# EAGLE design tiny84xbee-humi_dualProbe_v4 (EAGLE 5.10)
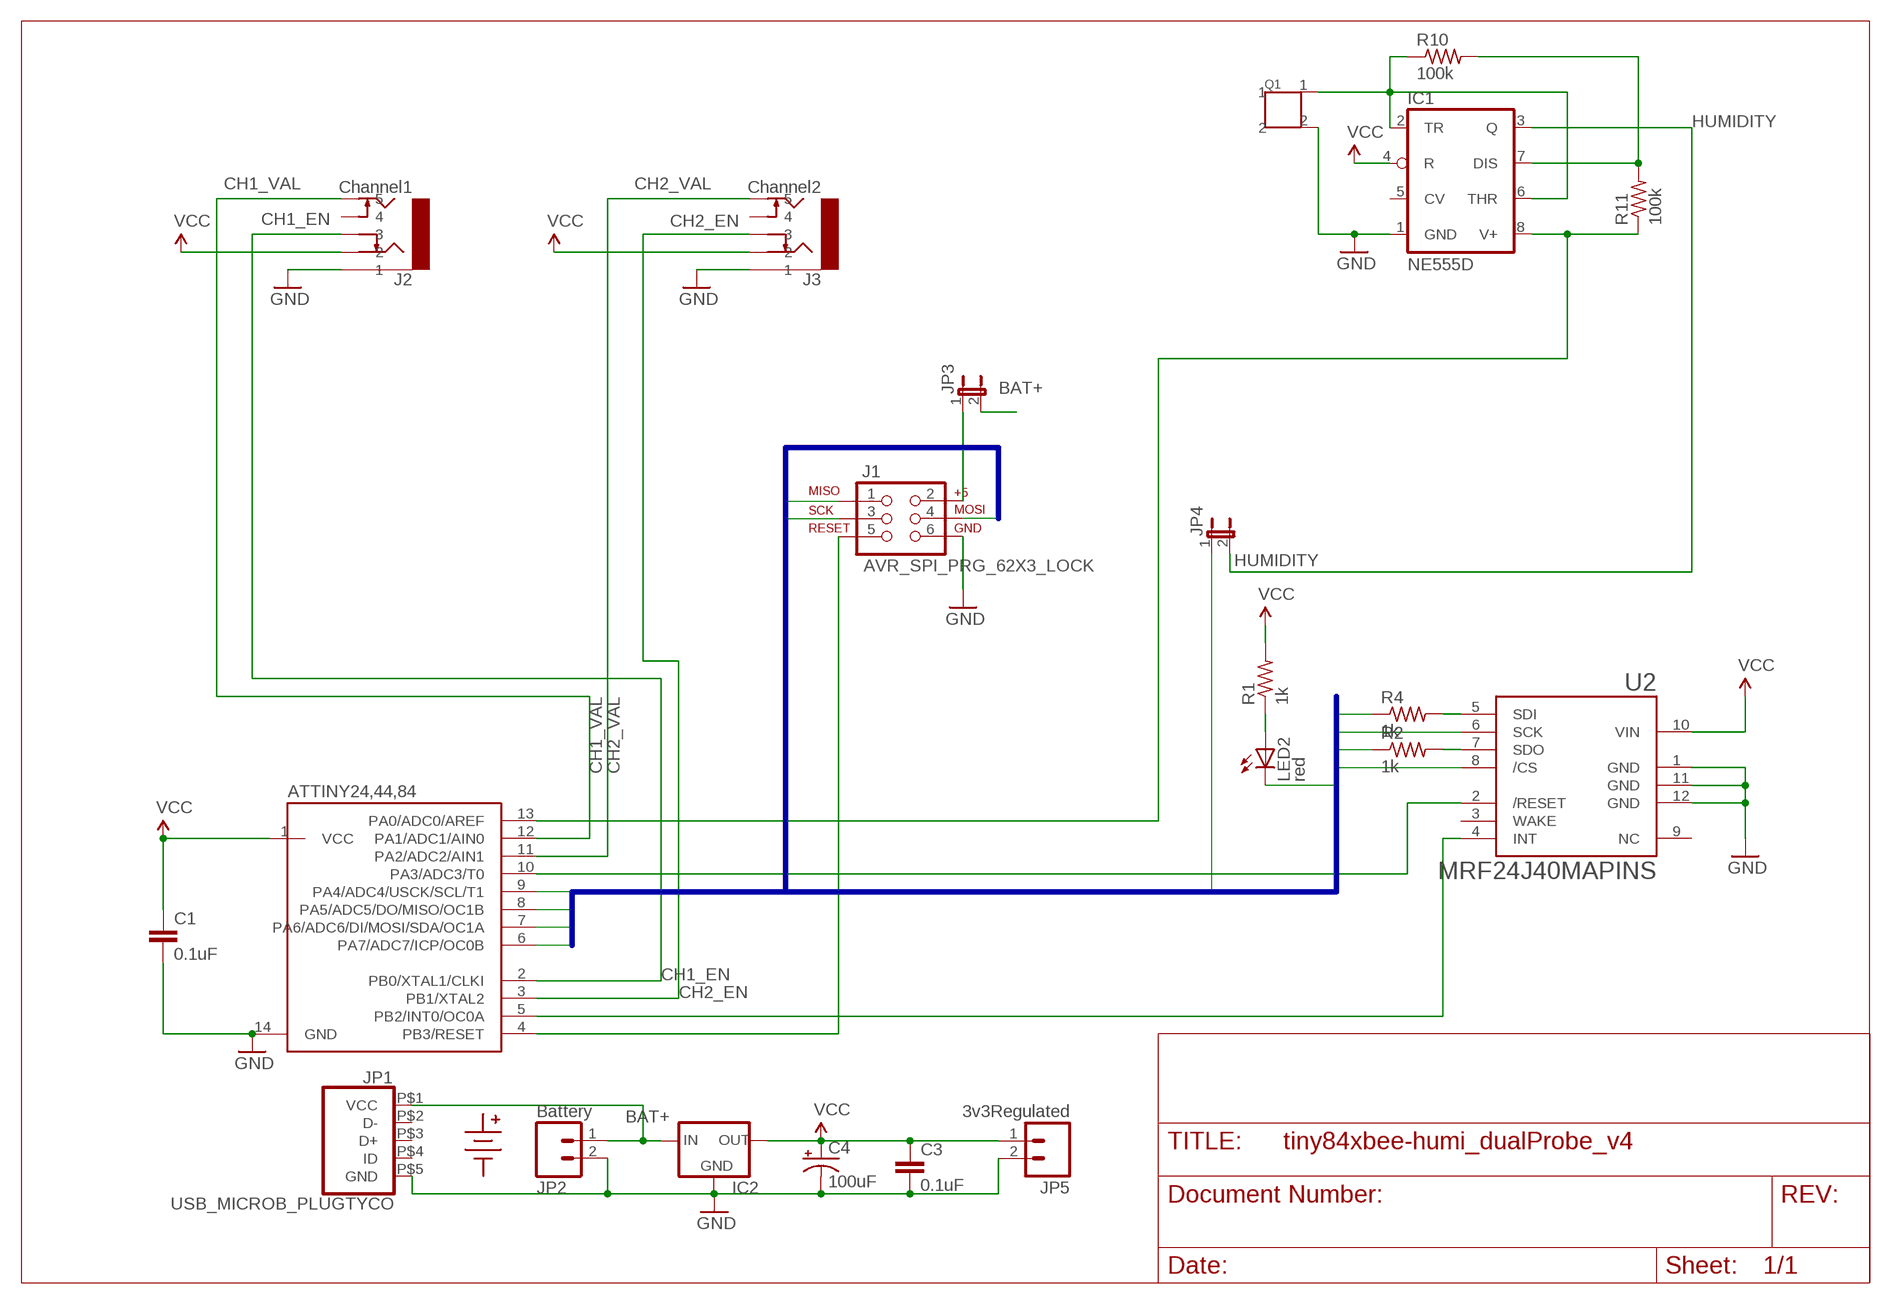
[diagram p0: schematic, sheet 1]

## Parts
ATTINY24,44,84  ATTINY24PDIP  [DIL14]
C1  0.1uF  C-EUC0805K  [C0805K]
C3  0.1uF  C-EU050-035X075  [C050-035X075]
C4  100uF  CPOL-USE2-5  [E2-5]
IC1  NE555D  [SO08]
IC2  MCP1700INLINE  [TO92-INLINE]
J1  AVR_SPI_PRG_62X3_LOCK  [2X3_LOCK]
J2  Channel1  AUDIO-JACK-5PKYCON-STX-315X-5-XX  [KYCON-STX-315X-5-XX]
J3  Channel2  AUDIO-JACK-5PKYCON-STX-315X-5-XX  [KYCON-STX-315X-5-XX]
JP1  USB_MICROB_PLUGTYCO  [TYCO_1981568_MICROB]
JP2  Battery  M02PTH  [1X02]
JP3  JUMPER-2PTH  [1X02]
JP4  JUMPER-2PTH  [1X02]
JP5  3v3Regulated  M02PTH  [1X02]
LED2  red  LED3MM  [LED3MM]
Q1  HCH1000  [HCH1000-001]
R1  1k  R-US_R0805  [R0805]
R2  1k  R-US_0207/10  [0207/10]
R4  1k  R-US_0207/10  [0207/10]
R10  100k  R-US_R0805  [R0805]
R11  100k  R-US_R0805  [R0805]
U2  MRF24J40MAPINS  [MRF24J40MA]
U$1  BATTERY_LEADS  [KEYSTONE-2463]

## Nets
/CS: ATTINY24,44,84.6(PA7/ADC7/ICP/OC0B) LED2.K(C) U2.8(/CS)
BAT+: IC2.2(IN) JP1.P$1(VCC) JP2.1 JP3.2
CH1_EN: ATTINY24,44,84.2(PB0/XTAL1/CLKI) J2.P$5
CH1_VAL: ATTINY24,44,84.12(PA1/ADC1/AIN0) J2.P$4
CH2_EN: ATTINY24,44,84.3(PB1/XTAL2) J3.P$5
CH2_VAL: ATTINY24,44,84.11(PA2/ADC2/AIN1) J3.P$4
GND: ATTINY24,44,84.14(GND) C1.2 C3.2 C4.- IC1.1(GND) IC2.1(GND) J1.6 J2.P$1 J3.P$1 JP1.P$5(GND) JP2.2 JP5.2 Q1.2 U2.1(GND) U2.11(GND) U2.12(GND)
HUMIDITY: IC1.3(Q) JP4.2
ICP5V: J1.2 JP3.1
MISO: ATTINY24,44,84.8(PA5/ADC5/DO/MISO/OC1B) J1.1 R2.1
MOSI: ATTINY24,44,84.7(PA6/ADC6/DI/MOSI/SDA/OC1A) J1.4 R4.1
N$1: IC1.2(TR) IC1.6(THR) Q1.1 R10.1
N$2: R2.2 U2.7(SDO)
N$3: R4.2 U2.5(SDI)
N$4: IC1.7(DIS) R10.2 R11.2
N$5: LED2.A R1.1
N$6: ATTINY24,44,84.4(PB3/RESET) J1.5
N$7: ATTINY24,44,84.10(PA3/ADC3/T0) U2.2(/RESET)
N$8: ATTINY24,44,84.13(PA0/ADC0/AREF) IC1.8(V+) R11.1
N$10: ATTINY24,44,84.5(PB2/INT0/OC0A) U2.4(INT)
SCK: ATTINY24,44,84.9(PA4/ADC4/USCK/SCL/T1) J1.3 JP4.1 U2.6(SCK)
VCC: ATTINY24,44,84.1(VCC) C1.1 C3.1 C4.+ IC1.4(R) IC2.3(OUT) J2.P$2 J3.P$2 JP5.1 R1.2 U2.10(VIN)
Unconnected: IC1.5(CV) J2.P$3 J3.P$3 JP1.P$2(D-) JP1.P$3(D+) JP1.P$4(ID) U2.3(WAKE) U2.9(NC)

## Buses
MISO,MOSI,SCK,/CS

## Library data of the parts
ATTINY24,44,84 = karlnet-parts:ATTINY24: ATtiny24/44/84. pdip and qfn packages, but the QFN package does _not_ have the bottom pad connected to ground. (doing so would make a 15 pad package, and you couldn't have PDIP and QFN in the same part)
C1 C3 = resistor:C-EU: CAPACITOR, European symbol
C4 = resistor:CPOL-US: POLARIZED CAPACITOR, American symbol
IC1 = adafruit:*555: TIMER Changed DIP package to have round (not oval) pin pads http://www.ladyada.net/library/pcb/eaglelibrary.html
IC2 = karlnet-parts:MCP1700: VOLTAGE REGULATOR
J1 = karlnet-parts:AVR_SPI_PRG_6: AVR ISP 6 Pin This is the reduced ISP connector for AVR programming. Common on Arduino. This footprint will take up less PCB space and can be used with a 10-pin to 6-pin adapter such as SKU: BOB-08508
J2 J3 = karlnet-parts:AUDIO-JACK-5P: Stereo Audio Jack, with switches for each signal contact
JP1 = karlnet-parts:USB_MICROB_PLUG: USB Micro-B Plug Comes in a variety of packages. Check out Hirose's ZX-x0 line: http://www.hirose.co.jp/cataloge_hp/e24200011.pdf
JP2 JP5 = SparkFun:M02: Header 2 Standard 2-pin 0.1" header. Use with straight break away headers (SKU : PRT-00116), right angle break away headers (PRT-00553), swiss pins (PRT-00743), machine pins (PRT-00117), and female headers (PRT-00115). Molex polarized connector foot print use with SKU : PRT-08233 with associated crimp pins and housings.
JP3 JP4 = SparkFun:JUMPER-2: Jumper Basic 0.1" spaced jumper. Use with breakaway headers.
LED2 = adafruit:LED: LED OSRAM: - CHIPLED LG R971, LG N971, LY N971, LG Q971, LY Q971, LO R971, LY R971 LH N974, LH R974 LS Q976, LO Q976, LY Q976 LO Q996 - Hyper CHIPLED LW Q18S LB Q993, LB Q99A, LB R99A - SideLED LS A670, LO A670, LY A670, LG A670, LP A670 LB A673, LV A673, LT A673, LW A673 LH A674 LY A675 LS A676, LA A676, LO A676, LY A676, LW A676 LS A679, LY A679, LG A679 - Hyper Micro SIDELED® LS Y876, LA Y876, LO Y876, LY Y876 LT Y87S - SmartLED LW L88C, LW L88S LB L89C, LB L89S, LG L890 LS L89K, LO L89K, LY L89K LS L896, LA L896, LO L896, LY L896 - TOPLED LS T670, LO T670, LY T670, LG T670, LP T670 LSG T670, LSP T670, LSY T670, LOP T670, LYG T670 LG T671, LOG T671, LSG T671 LB T673, LV T673, LT T673, LW T673 LH T674 LS T676, LA T676, LO T676, LY T676, LB T676, LH T676, LSB T676, LW T676 LB T67C, LV T67C, LT T67C, LS T67K, LO T67K, LY T67K, LW E67C LS E67B, LA E67B, LO E67B, LY E67B, LB E67C, LV E67C, LT E67C LW T67C LS T679, LY T679, LG T679 LS T770, LO T770, LY T770, LG T770, LP T770 LB T773, LV T773, LT T773, LW T773 LH T774 LS E675, LA E675, LY E675, LS T675 LS T776, LA T776, LO T776, LY T776, LB T776 LHGB T686 LT T68C, LB T68C - Hyper Mini TOPLED® LB M676 - Mini TOPLED Santana® LG M470 LS M47K, LO M47K, LY M47K Source: http://www.osram.convergy.de/
Q1 = karlnet-parts:HCH1000: HCH1000 Capacitive Humidity Sensor Honeywell, cheap, capacitance varies with humidity
R1 R2 R4 R10 R11 = resistor:R-US_: RESISTOR, American symbol
U2 = karlnet-parts:MRF24J40MA
U$1 = karlnet-parts:BATTERY_LEADS: Battery holders with leads, ie, mechanical placement only, no electrical connections

## Board
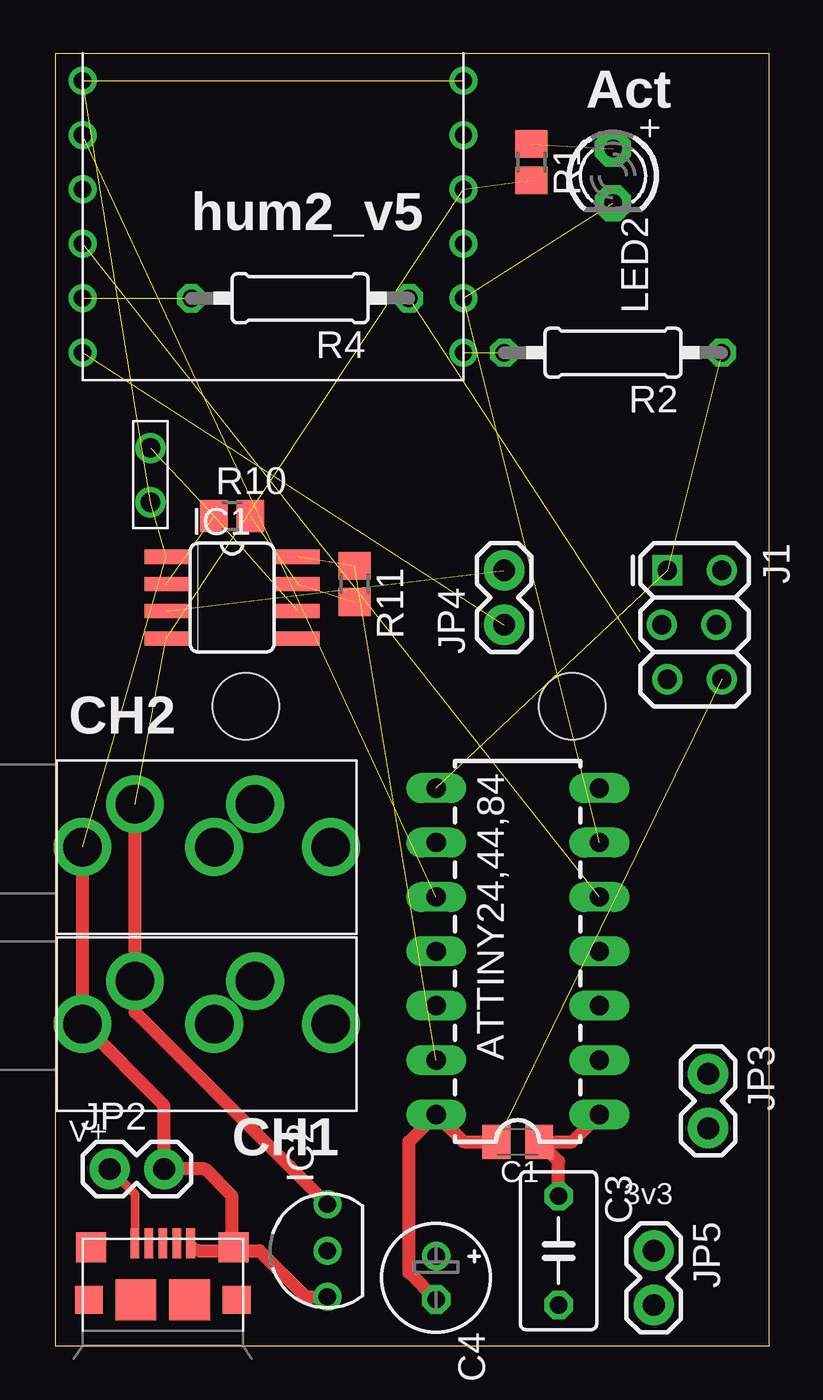
[diagram p1: board, top side]
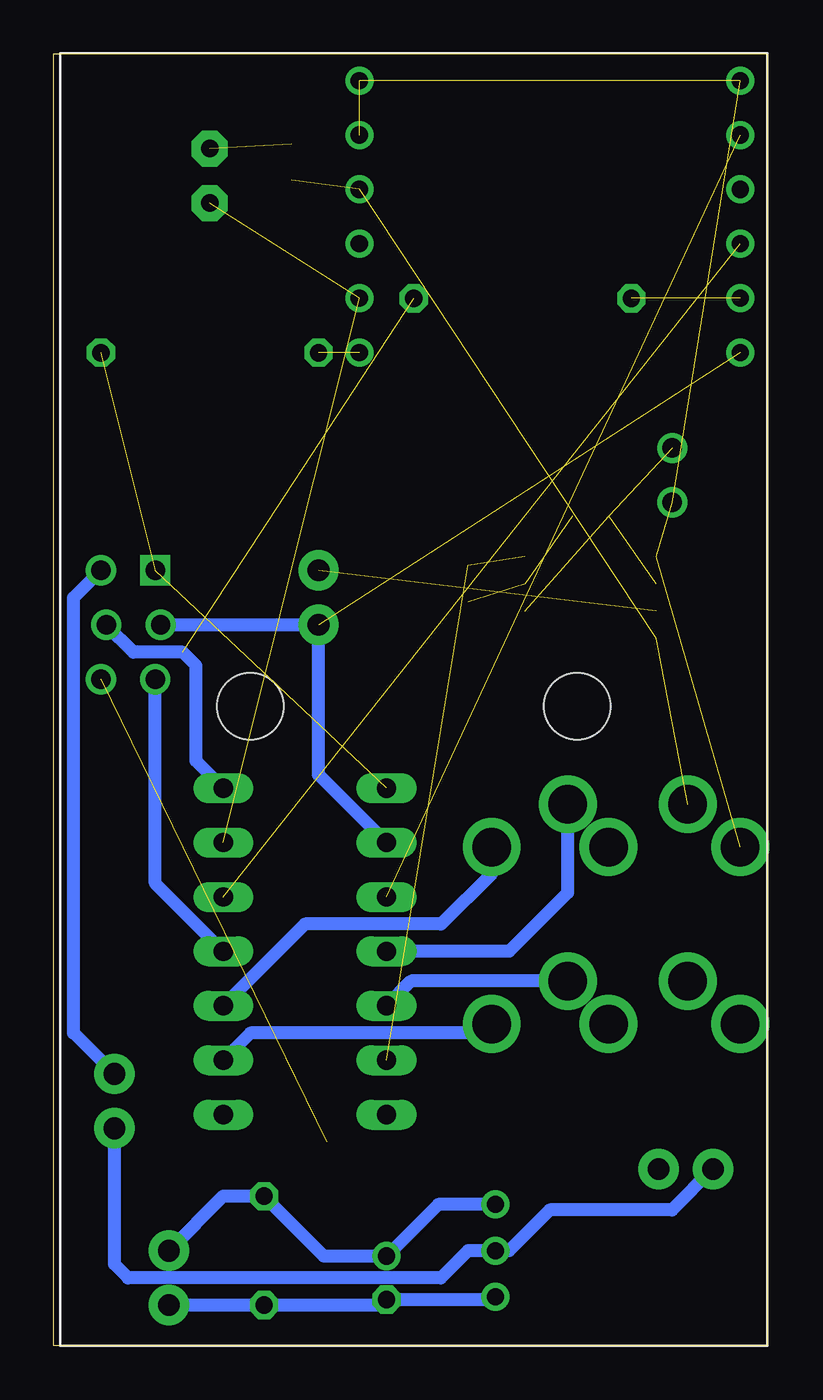
[diagram p2: board, bottom side, seen from below]

Size 33.33 x 60.31 mm. Coordinates in mm from the lower left corner, seen from the top.
Outline: 0,0 33.33,0 33.33,60.31 0,60.31 0,0
Copper layers (1*16): Top 0.035mm / dielectric 1.5mm / Bottom 0.035mm
Design rules "olimex-10mils": minimum track width 10mil, minimum drill 24mil, track to track 10mil, track to pad 10mil, pad to pad 10mil, via to via 10mil, smd to smd 10mil, copper to edge 40mil, drill to drill 10mil, minimum pad ring 10mil, minimum via ring 8mil, stop-mask expansion 0mil, vias tented up to drill 0mil, thermal gap 10mil

### Footprints (pad centres in the part's own frame; a part is rotated, then mirrored left to right if it is on the bottom)
DIL14 = drill 0.9 long: 1 -8.89,-3.81; 2 -6.35,-3.81; 3 -3.81,-3.81; 4 -1.27,-3.81; 5 1.27,-3.81; 6 3.81,-3.81; 7 6.35,-3.81; 8 6.35,3.81; 9 3.81,3.81; 10 1.27,3.81; 11 -1.27,3.81; 12 -3.81,3.81; 13 -6.35,3.81; 14 -8.89,3.81
C0805K = smd 1.3 x 1.6: 1 -1,0; 2 1,0
C050-035X075 = drill 0.813 octagon: 1 -2.54,0; 2 2.54,0
E2-5 = drill 0.813 pad 1.27 round: + -1.016,0 | drill 0.813 pad 1.27 octagon: - 1.016,0
SO08 = smd 0.66 x 2.032: 1 -1.905,-3.073; 2 -0.635,-3.073; 3 0.635,-3.073; 4 1.905,-3.073; 5 1.905,3.073; 6 0.635,3.073; 7 -0.635,3.073; 8 -1.905,3.073
TO92-INLINE = drill 0.8 round: 1 -2.159,0; 2 0,0; 3 2.159,0
2X3_LOCK = drill 0.9 square: 1 0,0 | drill 0.9 round: 2 0,2.54; 3 2.54,-0.254; 4 2.54,2.286; 5 5.08,0; 6 5.08,2.54
KYCON-STX-315X-5-XX = drill 1.8 pad 2.3 round: P$1 -3.88,0.42; P$2 -1.43,2.42; P$3 2.27,0.42; P$4 4.17,2.42; P$5 7.72,0.42
TYCO_1981568_MICROB = smd 0.4 x 1.4: P$1 2.45,4.8; P$2 3.1,4.8; P$3 3.75,4.8; P$4 4.4,4.8; P$5 5.05,4.8 | smd 1.3 x 1.3: P$6 0.3,2.15; P$7 7.2,2.15 | smd 1.9 x 1.9: P$8 2.5,2.15; P$9 5,2.15 | smd 1.4 x 1.4: P$10 0.4,4.6; P$11 7.05,4.6
1X02 = drill 1.016 pad 1.88 round: 1 0,0; 2 2.54,0
LED3MM = drill 0.813 pad 1.676 octagon: A -1.27,0; K 1.27,0
HCH1000-001 = drill 0.9 round: 1 -2.54,0; 2 0,0
R0805 = smd 1.3 x 1.5: 1 -0.85,0; 2 0.85,0
0207/10 = drill 0.813 octagon: 1 -5.08,0; 2 5.08,0
MRF24J40MA = drill 0.8 round: 1 -8.89,12.7; 2 -8.89,10.16; 3 -8.89,7.62; 4 -8.89,5.08; 5 -8.89,2.54; 6 -8.89,0; 7 8.89,0; 8 8.89,2.54; 9 8.89,5.08; 10 8.89,7.62; 11 8.89,10.16; 12 8.89,12.7
KEYSTONE-2463 = hole 3.1: 29.845,8.89; 29.845,24.13

### Placement (x,y rotation side)
ATTINY24,44,84  21.59,19.68 90 top
C1  21.59,9.53 180 top
C3  23.5,4.45 270 top
C4  17.78,3.17 270 top
IC1  8.26,34.92 270 top
IC2  12.7,4.45 90 top
J1  28.57,36.2 270 top
J2  5.15,14.61 0 top
J3  5.15,22.86 0 top
JP1  1.27,0 0 top
JP2  2.54,8.26 0 top
JP3  30.48,12.7 270 top
JP4  20.95,33.66 90 top
JP5  27.94,4.45 270 top
LED2  26.04,54.61 270 top
Q1  4.45,39.37 270 top
R1  22.23,55.24 270 top
R2  26.04,46.35 180 top
R4  11.43,48.9 180 top
R10  8.26,38.73 0 top
R11  13.97,35.56 270 top
U2  10.16,46.35 0 top
U$1  33.02,0 90 top

### Tracks (layer width: path | path; a pad name or v marks a point on that pad's centre or on a via)
/CS  (2 unrouted)
BAT+
  Top 0.406: JP1.P$1 3.72,7.08 JP2.1
  Bottom 0.61: JP2.1 4.45,6.35 10.16,6.35 12.06,4.45 IC2.2 13.97,4.45 15.24,3.17 29.84,3.17 30.48,3.81 JP3.2
CH1_EN
  Bottom 0.61: ATTINY24,44,84.2 24.13,14.61 13.29,14.61 arc-90 J2.P$5
CH1_VAL
  Bottom 0.61: ATTINY24,44,84.12 16.63,17.02 J2.P$4
CH2_EN
  Bottom 0.61: ATTINY24,44,84.3 21.59,19.68 15.24,19.68 12.87,22.05 J3.P$5
CH2_VAL
  Bottom 0.61: ATTINY24,44,84.11 12.06,18.41 9.32,21.16 J3.P$4
GND  (6 unrouted)
  Top 0.406: JP1.P$5 6.67,4.45
  Top 0.61: IC2.1 11.68,2.29 9.53,4.45 8.26,4.45 | 6.67,4.45 8.26,4.45 | 8.26,4.45 8.26,6.99 6.99,8.26 JP2.2 5.08,11.21 J2.P$1 J3.P$1 | C1.2 19.05,9.53 ATTINY24,44,84.14 16.51,9.53 16.51,3.43 C4.-
  Bottom 0.61: JP5.2 C3.2 18.03,1.91 C4.- 12.83,2.16 IC2.1
HUMIDITY  (1 unrouted)
ICP5V
  Bottom 0.61: J1.2 32.38,34.92 32.38,14.61 JP3.1
MISO  (2 unrouted)
MOSI  (1 unrouted)
  Bottom 0.61: J1.4 29.59,32.38 27.3,32.38 26.67,31.75 26.67,27.3 ATTINY24,44,84.7
N$1  (3 unrouted)
N$2  (1 unrouted)
N$3  (1 unrouted)
N$4  (2 unrouted)
N$5  (1 unrouted)
N$6
  Bottom 0.61: ATTINY24,44,84.4 28.57,21.59 J1.5
N$7  (1 unrouted)
N$8  (2 unrouted)
N$10  (1 unrouted)
SCK  (1 unrouted)
  Bottom 0.61: ATTINY24,44,84.9 20.95,26.67 JP4.1 J1.3
VCC  (3 unrouted)
  Top 0.61: C3.1 23.5,8.62 C1.1 24.13,9.53 ATTINY24,44,84.1 | J3.P$2 J2.P$2 3.72,15.58 IC2.3
  Bottom 0.61: IC2.3 15.37,6.6 C4.+ 20.7,4.19 C3.1 25.4,6.99 JP5.1

### Text on the board
tPlace: Act | hum2_v5 | CH2 | HUM | V+ | CH1 | 3v3 | Host